# Altium schematic sheet project.schdoc
size 424 x 192 mm
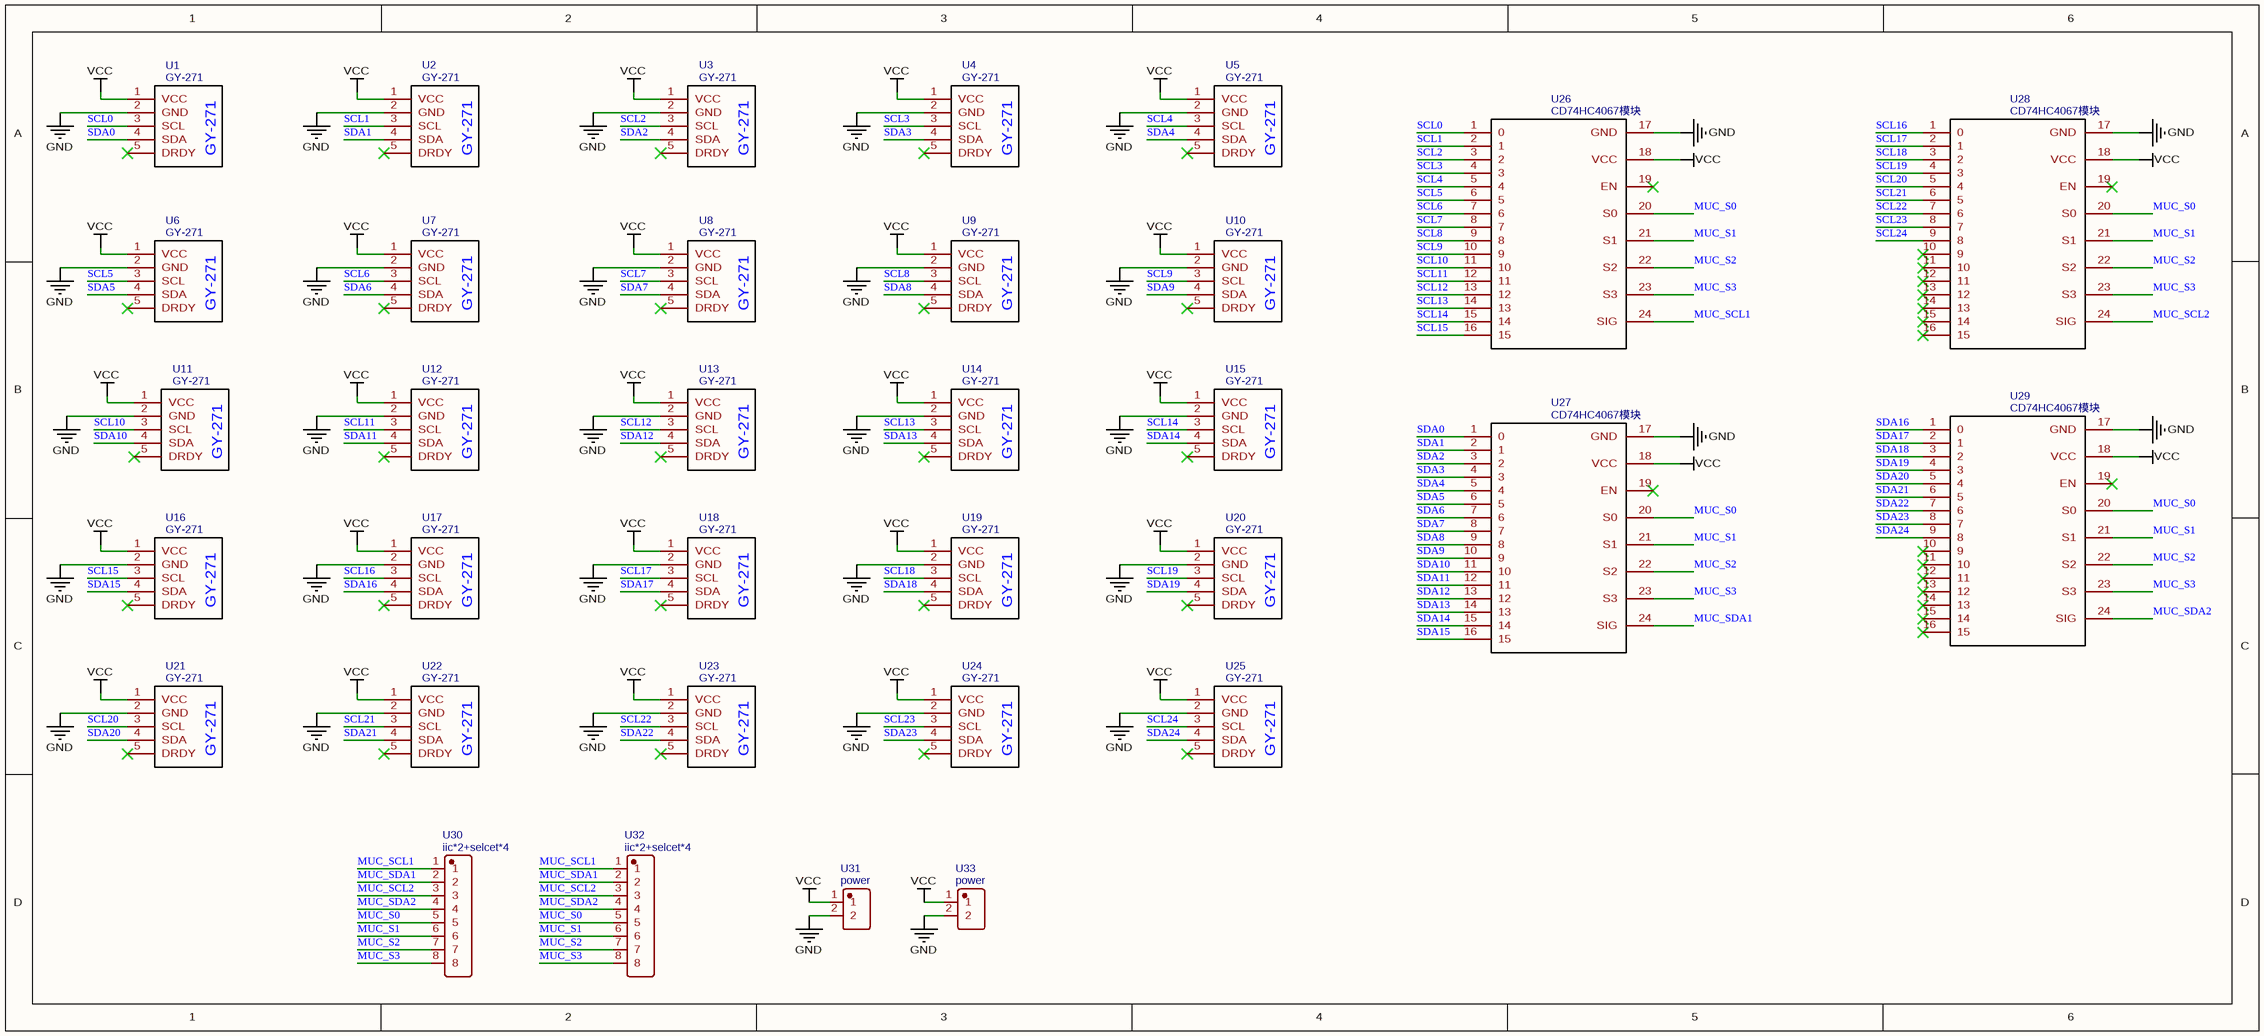
[diagram p0: project.schdoc]

## Parts
U1  GY-271  [GY-271]
U2  GY-271  [GY-271]
U3  GY-271  [GY-271]
U4  GY-271  [GY-271]
U5  GY-271  [GY-271]
U6  GY-271  [GY-271]
U7  GY-271  [GY-271]
U8  GY-271  [GY-271]
U9  GY-271  [GY-271]
U10  GY-271  [GY-271]
U11  GY-271  [GY-271]
U12  GY-271  [GY-271]
U13  GY-271  [GY-271]
U14  GY-271  [GY-271]
U15  GY-271  [GY-271]
U16  GY-271  [GY-271]
U17  GY-271  [GY-271]
U18  GY-271  [GY-271]
U19  GY-271  [GY-271]
U20  GY-271  [GY-271]
U21  GY-271  [GY-271]
U22  GY-271  [GY-271]
U23  GY-271  [GY-271]
U24  GY-271  [GY-271]
U25  GY-271  [GY-271]
U26  CD74HC4067模块  [CD74HC4067]
U27  CD74HC4067模块  [CD74HC4067]
U28  CD74HC4067模块  [CD74HC4067]
U29  CD74HC4067模块  [CD74HC4067]
U30  iic*2+selcet*4  [HDR-TH_8P-P2.54-V-F]
U31  power  [HDR-TH_2P-P2.54-V-M]
U32  iic*2+selcet*4  [HDR-TH_8P-P2.54-V-F]
U33  power  [HDR-TH_2P-P2.54-V-M]

## Nets
GND: U1.2(GND) U2.2(GND) U3.2(GND) U4.2(GND) U5.2(GND) U6.2(GND) U7.2(GND) U8.2(GND) U9.2(GND) U10.2(GND) U11.2(GND) U12.2(GND) U13.2(GND) U14.2(GND) U15.2(GND) U16.2(GND) U17.2(GND) U18.2(GND) U19.2(GND) U20.2(GND) U21.2(GND) U22.2(GND) U23.2(GND) U24.2(GND) U25.2(GND) U26.17(GND) U27.17(GND) U28.17(GND) U29.17(GND) U31.2 U33.2
VCC: U1.1(VCC) U2.1(VCC) U3.1(VCC) U4.1(VCC) U5.1(VCC) U6.1(VCC) U7.1(VCC) U8.1(VCC) U9.1(VCC) U10.1(VCC) U11.1(VCC) U12.1(VCC) U13.1(VCC) U14.1(VCC) U15.1(VCC) U16.1(VCC) U17.1(VCC) U18.1(VCC) U19.1(VCC) U20.1(VCC) U21.1(VCC) U22.1(VCC) U23.1(VCC) U24.1(VCC) U25.1(VCC) U26.18(VCC) U27.18(VCC) U28.18(VCC) U29.18(VCC) U31.1 U33.1
MUC_S0: U26.20(S0) U27.20(S0) U28.20(S0) U29.20(S0) U30.5 U32.5
MUC_S1: U26.21(S1) U27.21(S1) U28.21(S1) U29.21(S1) U30.6 U32.6
MUC_S2: U26.22(S2) U27.22(S2) U28.22(S2) U29.22(S2) U30.7 U32.7
MUC_S3: U26.23(S3) U27.23(S3) U28.23(S3) U29.23(S3) U30.8 U32.8
MUC_SCL1: U26.24(SIG) U30.1 U32.1
MUC_SCL2: U28.24(SIG) U30.3 U32.3
MUC_SDA1: U27.24(SIG) U30.2 U32.2
MUC_SDA2: U29.24(SIG) U30.4 U32.4
SCL0: U1.3(SCL) U26.1(0)
SCL1: U2.3(SCL) U26.2(1)
SCL2: U3.3(SCL) U26.3(2)
SCL3: U4.3(SCL) U26.4(3)
SCL4: U5.3(SCL) U26.5(4)
SCL5: U6.3(SCL) U26.6(5)
SCL6: U7.3(SCL) U26.7(6)
SCL7: U8.3(SCL) U26.8(7)
SCL8: U9.3(SCL) U26.9(8)
SCL9: U10.3(SCL) U26.10(9)
SCL10: U11.3(SCL) U26.11(10)
SCL11: U12.3(SCL) U26.12(11)
SCL12: U13.3(SCL) U26.13(12)
SCL13: U14.3(SCL) U26.14(13)
SCL14: U15.3(SCL) U26.15(14)
SCL15: U16.3(SCL) U26.16(15)
SCL16: U17.3(SCL) U28.1(0)
SCL17: U18.3(SCL) U28.2(1)
SCL18: U19.3(SCL) U28.3(2)
SCL19: U20.3(SCL) U28.4(3)
SCL20: U21.3(SCL) U28.5(4)
SCL21: U22.3(SCL) U28.6(5)
SCL22: U23.3(SCL) U28.7(6)
SCL23: U24.3(SCL) U28.8(7)
SCL24: U25.3(SCL) U28.9(8)
SDA0: U1.4(SDA) U27.1(0)
SDA1: U2.4(SDA) U27.2(1)
SDA2: U3.4(SDA) U27.3(2)
SDA3: U4.4(SDA) U27.4(3)
SDA4: U5.4(SDA) U27.5(4)
SDA5: U6.4(SDA) U27.6(5)
SDA6: U7.4(SDA) U27.7(6)
SDA7: U8.4(SDA) U27.8(7)
SDA8: U9.4(SDA) U27.9(8)
SDA9: U10.4(SDA) U27.10(9)
SDA10: U11.4(SDA) U27.11(10)
SDA11: U12.4(SDA) U27.12(11)
SDA12: U13.4(SDA) U27.13(12)
SDA13: U14.4(SDA) U27.14(13)
SDA14: U15.4(SDA) U27.15(14)
SDA15: U16.4(SDA) U27.16(15)
SDA16: U17.4(SDA) U29.1(0)
SDA17: U18.4(SDA) U29.2(1)
SDA18: U19.4(SDA) U29.3(2)
SDA19: U20.4(SDA) U29.4(3)
SDA20: U21.4(SDA) U29.5(4)
SDA21: U22.4(SDA) U29.6(5)
SDA22: U23.4(SDA) U29.7(6)
SDA23: U24.4(SDA) U29.8(7)
SDA24: U25.4(SDA) U29.9(8)

Not connected (* = marked no-connect by the designer): U1 5(DRDY)*; U2 5(DRDY)*; U3 5(DRDY)*; U4 5(DRDY)*; U5 5(DRDY)*; U6 5(DRDY)*; U7 5(DRDY)*; U8 5(DRDY)*; U9 5(DRDY)*; U10 5(DRDY)*; U11 5(DRDY)*; U12 5(DRDY)*; U13 5(DRDY)*; U14 5(DRDY)*; U15 5(DRDY)*; U16 5(DRDY)*; U17 5(DRDY)*; U18 5(DRDY)*; U19 5(DRDY)*; U20 5(DRDY)*; U21 5(DRDY)*; U22 5(DRDY)*; U23 5(DRDY)*; U24 5(DRDY)*; U25 5(DRDY)*; U26 19(EN)*; U27 19(EN)*; U28 10(9)* 11(10)* 12(11)* 13(12)* 14(13)* 15(14)* 16(15)* 19(EN)*; U29 10(9)* 11(10)* 12(11)* 13(12)* 14(13)* 15(14)* 16(15)* 19(EN)*

## Library data of the parts
U1-U25 = GY-271: Contributor: shenmz; spicePre: U; spiceSymbolName: GY-271
U26-U29 = CD74HC4067模块: Contributor: ShenMZ; spicePre: U; spiceSymbolName: CD74HC4067模块
U30 U32 = iic*2+selcet*4: Manufacturer: Bossie(博锡); Manufacturer Part: BX-PM2.54-1-8PY; Contributor: lcsc; Supplier: LCSC; Supplier Part: C18078131; JLCPCB Part Class: Extended Part; spicePre: U; spiceSymbolName: BX-PM2.54-1-8PY
U31 U33 = power: Manufacturer: Megastar(兆星); Manufacturer Part: ZX-PZ2.54-1-2PZZ; Contributor: lcsc; Supplier: LCSC; Supplier Part: C7501260; JLCPCB Part Class: Extended Part; spicePre: U; spiceSymbolName: ZX-PZ2.54-1-2PZZ